# Altium schematic sheet ST-Link-V2.1.SchDoc
size A4; SheetNumber: 1; SheetTotal: 1
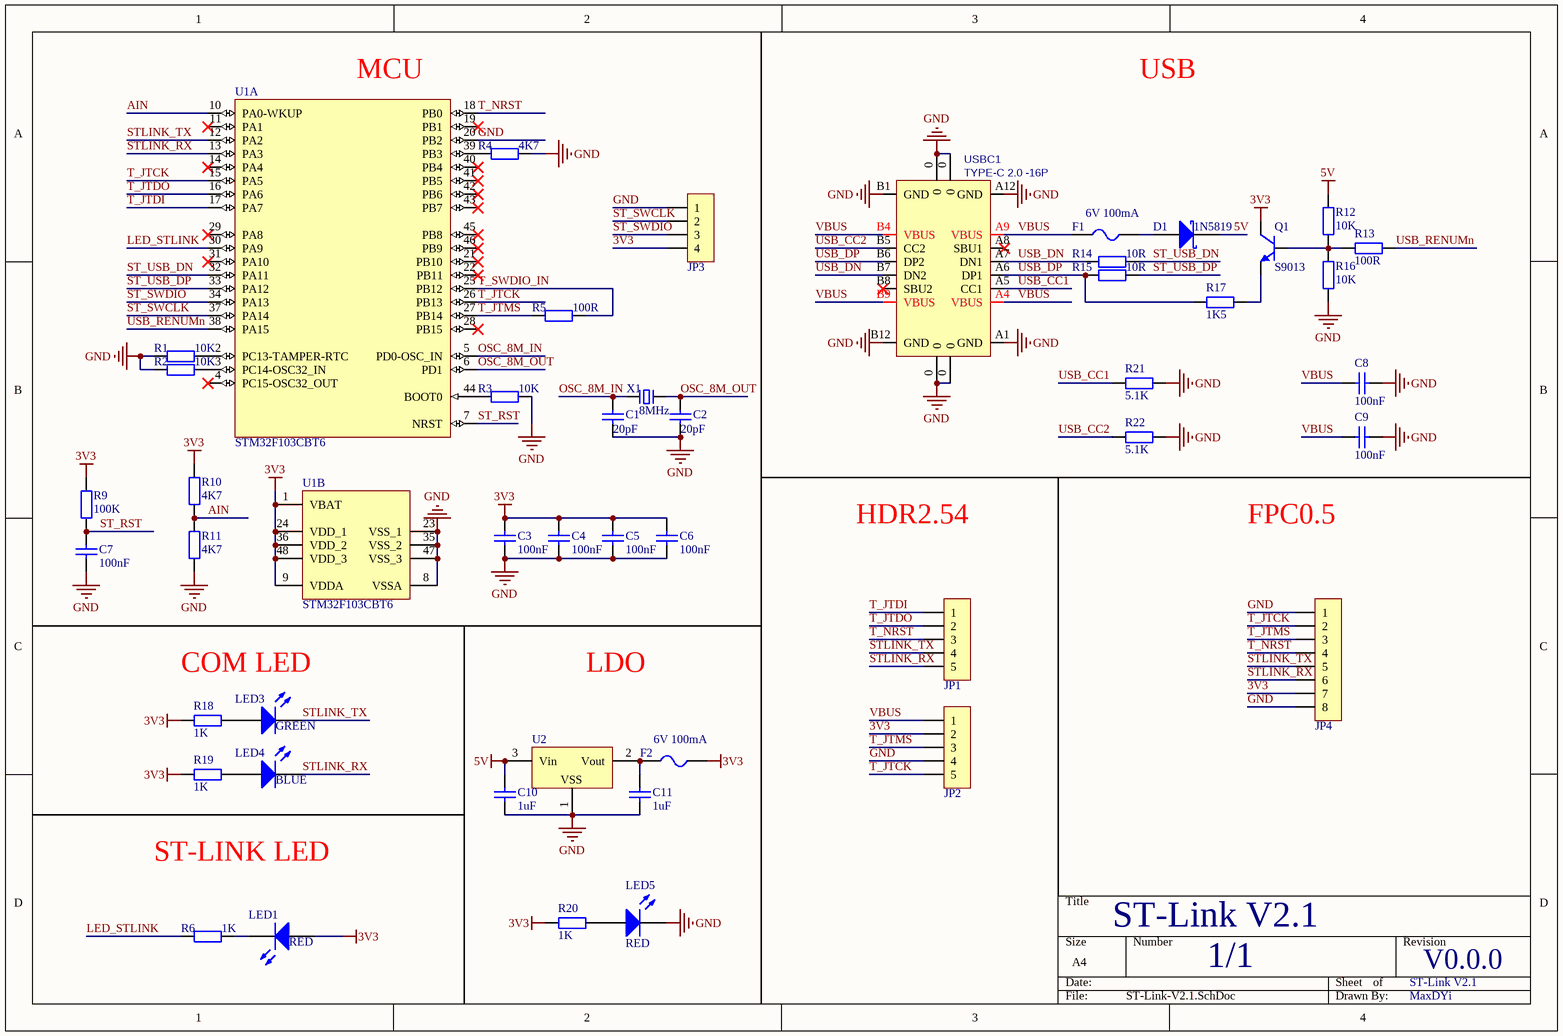
[diagram p0: ST-Link-V2.1.SchDoc]

## Parts
C1  20pF  [C0402_M]
C2  20pF  [C0402_M]
C3  100nF  [C0402_M]
C4  100nF  [C0402_M]
C5  100nF  [C0402_M]
C6  100nF  [C0402_M]
C7  100nF  [C0402_M]
C8  100nF  [C0402_M]
C9  100nF  [C0402_M]
C10  1uF  [C0402_M]
C11  1uF  [C0402_M]
D1  1N5819  [SOD-323]
F1  6V 100mA  [F0805]
F2  6V 100mA  [F0805]
JP1  HDR-1X5  [HDR2.54-WS-5P]  (value not drawn)
JP2  HDR-1X5  [HDR2.54-WS-5P]  (value not drawn)
JP3  HDR-1X4  [HDR1.27-LI-4P]  (value not drawn)
JP4  CON-8P  [FPC0.5-WT-8P-双侧触点]  (value not drawn)
LED1  RED  [LED0603_R]
LED3  GREEN  [LED0603_G]
LED4  BLUE  [LED0603_B]
LED5  RED  [LED0603_R]
Q1  S9013  [SOT23-3N]
R1  10K  [R0402_M]
R2  10K  [R0402_M]
R3  10K  [R0402_M]
R4  4K7  [R0402_M]
R5  100R  [R0402_M]
R6  1K  [R0402_M]
R9  100K  [R0402_M]
R10  4K7  [R0402_M]
R11  4K7  [R0402_M]
R12  10K  [R0402_M]
R13  100R  [R0402_M]
R14  10R  [R0402_M]
R15  10R  [R0402_M]
R16  10K  [R0402_M]
R17  1K5  [R0402_M]
R18  1K  [R0402_M]
R19  1K  [R0402_M]
R20  1K  [R0402_M]
R21  5.1K  [R0402_M]
R22  5.1K  [R0402_M]
U1  STM32F103CBT6  [STM-LQFP48_N]  (parts A,B of 2)
U2  XC6206P332MR  [SOT23-3N]  (value not drawn)
USBC1  TYPE-C 2.0 -16P  [USB-C-SMD_16P]
X1  8MHz  [OSC-5032-2P]

## Nets
3V3: C3.2 C4.2 C5.2 C6.2 F2.1 JP2.2 JP3.4 JP4.7 LED1.1(A) Q1.3(C) R9.2 R10.2 R18.2 R19.2 R20.2 U1.1(VBAT) U1.9(VDDA) U1.24(VDD_1) U1.36(VDD_2) U1.48(VDD_3)
5V: C10.2 D1.2(K) R12.2 U2.3(Vin)
GND: C1.1 C2.1 C3.1 C4.1 C5.1 C6.1 C7.1 C8.2 C9.2 C10.1 C11.1 JP2.4 JP3.1 JP4.1 JP4.8 LED5.2(K) R1.1 R2.1 R3.2 R4.2 R11.1 R16.1 R21.1 R22.1 U1.8(VSSA) U1.20(PB2) U1.23(VSS_1) U1.35(VSS_2) U1.47(VSS_3) U2.1(GND) USBC1.0 USBC1.A1(GND) USBC1.A12(GND) USBC1.B1(GND) USBC1.B12(GND)
AIN: R10.1 R11.2 U1.10(PA0-WKUP)
LED_STLINK: R6.1 U1.30(PA9)
OSC_8M_IN: C1.2 U1.5(PD0-OSC_IN) X1.1
OSC_8M_OUT: C2.2 U1.6(PD1) X1.2
ST_RST: C7.2 R9.1 U1.7(NRST)
ST_SWCLK: JP3.2 U1.37(PA14)
ST_SWDIO: JP3.3 U1.34(PA13)
ST_USB_DN: R14.2 U1.32(PA11)
ST_USB_DP: R15.2 U1.33(PA12)
STLINK_RX: JP1.5 JP4.6 LED4.2(K) U1.13(PA3)
STLINK_TX: JP1.4 JP4.5 LED3.2(K) U1.12(PA2)
T_JTCK: JP2.5 JP4.2 U1.15(PA5) U1.26(PB13)
T_JTDI: JP1.1 U1.17(PA7)
T_JTDO: JP1.2 U1.16(PA6)
T_JTMS: JP2.3 JP4.3 R5.1 U1.27(PB14)
T_NRST: JP1.3 JP4.4 U1.18(PB0)
T_SWDIO_IN: R5.2 U1.25(PB12)
USB_CC1: R21.2 USBC1.A5(CC1)
USB_CC2: R22.2 USBC1.B5(CC2)
USB_DN: R14.1 USBC1.A7(DN1) USBC1.B7(DN2)
USB_DP: R15.1 R17.1 USBC1.A6(DP1) USBC1.B6(DP2)
USB_RENUMn: R13.1 U1.38(PA15)
VBUS: C8.1 C9.1 F1.2 JP2.1 USBC1.A4(VBUS) USBC1.A9(VBUS) USBC1.B4(VBUS) USBC1.B9(VBUS)
NetC11_2: C11.2 F2.2 U2.2(Vout)
NetD1_1: D1.1(A) F1.1
NetLED1_2: LED1.2(K) R6.2
NetLED3_1: LED3.1(A) R18.1
NetLED4_1: LED4.1(A) R19.1
NetLED5_1: LED5.1(A) R20.1
NetQ1_1: Q1.1(B) R12.1 R13.2 R16.2
NetQ1_2: Q1.2(E) R17.2
NetR1_2: R1.2 U1.2(PC13-TAMPER-RTC)
NetR2_2: R2.2 U1.3(PC14-OSC32_IN)
NetR3_1: R3.1 U1.44(BOOT0)
NetR4_1: R4.1 U1.39(PB3)

Not connected (* = marked no-connect by the designer): U1 4(PC15-OSC32_OUT)* 11(PA1)* 14(PA4)* 19(PB1)* 21(PB10)* 22(PB11)* 28(PB15)* 29(PA8)* 31(PA10)* 40(PB4)* 41(PB5)* 42(PB6)* 43(PB7)* 45(PB8)* 46(PB9)*; USBC1 A8(SBU1)* B8(SBU2)*

## Notes on the sheet
- (near U1) MCU
- USB
- HDR2.54
- FPC0.5
- COM LED
- LDO
- ST-LINK LED
- ST-Link V2.1
- 1/1
- V0.0.0
- MaxDYi
- (in symbol XC6206P332MR) VSS

## Library data of the parts
C1-C11 = C: 贴片电容/MLCC电容; BOM名称: 无极性贴片电容; 联系下单店铺卖家 免费帮你查找封装: 联系下单店铺卖家 免费技术支持
D1 = 1N5819: 肖特基二极管; 当前库版本V2022.10.7 @淘宝卖家:黄晶宝石: 最新版本发布https://shop463601444.taobao.com; BOM名称: 肖特基二极管
F1 F2 = FUSE-8.5*4.0*8.0: 方形保险丝; BOM名称: 5*20保险丝; 联系下单店铺卖家 免费帮你查找封装: 联系下单店铺卖家 免费技术支持
JP1 JP2 = Header 5: 5P接插件; 联系卖家，免费查找封装: 唯一出售店铺网址https://shop463601444.taobao.com; 封装库来自淘宝卖家ID：黄晶宝石: 其他店铺购入均为盗版封装库，请立即申请退款，本店现金奖励50~200元; BOM名称: 5P接插件
JP3 = Header 4: 4P接插件; 联系卖家，免费查找封装: 唯一出售店铺网址https://shop463601444.taobao.com; 封装库来自淘宝卖家ID：黄晶宝石: 其他店铺购入均为盗版封装库，请立即申请退款，本店现金奖励50~200元; BOM名称: 4P接插件
JP4 = Header 8: 8P连接器; 封装库来自淘宝卖家: 黄晶宝石: 最新版本发布https://shop463601444.taobao.com; BOM名称: 8P连接器
LED1 LED3-LED5 = LED: 贴片LED; 封装库来自淘宝卖家：黄晶宝石: 其他店铺购入均为盗版封装库，无更新权益，退款现金奖励200~1000元; BOM名称: 贴片LED
Q1 = 9013-SMD: 低频放大-NPN型; 参数: 50V?0.5A?0.625W; 联系下单店铺卖家 免费帮你查找封装: 联系下单店铺卖家 免费技术支持; BOM名称: 低频放大-NPN型
R1-R6 R9-R22 = R: 贴片电阻; 当前库版本V2022.10.7 @黄晶宝石: 最新版本发布https://shop463601444.taobao.com; BOM名称: 贴片电阻
U1 = STM32F103CBT6: STM32 ARM-based 32-bit MCU Performance Line with 128 kB Flash, 20 kB Internal RAM, -40 to +85癈 Temperature, 48-Pin LQFP, Tray; 封装库来自淘宝卖家：黄晶宝石: 最新版本发布https://shop463601444.taobao.com; DatasheetVersion: rev13.0, Apr-2011; PackageVersion: rev13, Apr-2011; PackageReference: LQFP48; PackageDescription: 48-Pin Low-Profile Quad Flat Pack, 7 x 7 mm Body, 0.5 mm Pitch (LQFP48); ComponentLink1Description: Manufacturer URL; ComponentLink1URL: http://www.st.com/; ComponentLink2Description: STM32F103 Datasheet; ComponentLink2URL: http://www.st.com/internet/com/TECHNICAL_RESOURCES/TECHNICAL_LITERATURE/DATASHEET/CD00161566.pdf; ComponentLink3Description: STM32 Family Web Page; ComponentLink3URL: www.st.com/stm32
U2 = XC6206P332MR: LDO 3.3V/0.25A; 当前库版本V2022.10.7 @淘宝卖家:黄晶宝石: 最新版本发布https://shop463601444.taobao.com
USBC1 = USB2.0_Type-C_16Pin: USB2.0_Type-C_16Pin母座; 当前库版本V2022.10.7 @淘宝卖家:黄晶宝石: 最新版本发布https://shop463601444.taobao.com
X1 = XTAL-2P: 2脚无源晶振(谐振器）; 当前库版本V2022.10.7 @黄晶宝石: 最新版本发布https://shop463601444.taobao.com; BOM名称: 2脚无源晶振(谐振器）